# Altium project SSL-MainBoard-2020.PrjPcb
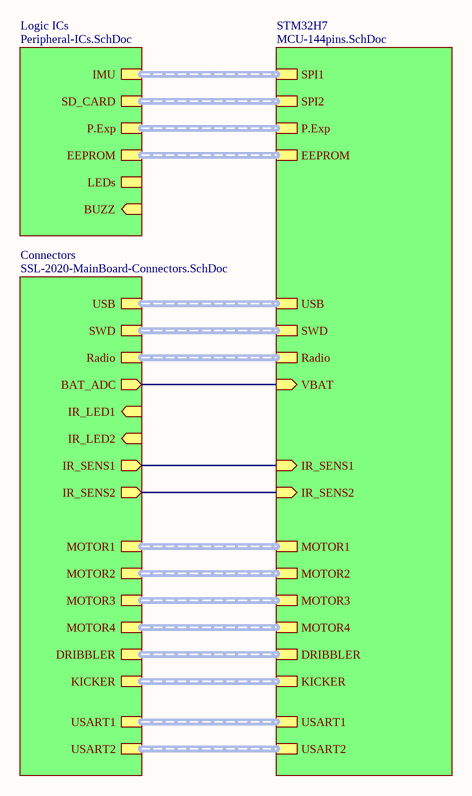
[diagram p0: SSL-2020-MainBoard.SchDoc]
4 sheets, 106 parts. Net scope: hierarchical (ports join the sheet entries above them; power ports are global).
Board file: SSL-2020-MainBoard1.PcbDoc
Sheets:
  SSL-2020-MainBoard.SchDoc
    Logic ICs = Peripheral-ICs.SchDoc
    STM32H7 = MCU-144pins.SchDoc
    Connectors = SSL-2020-MainBoard-Connectors.SchDoc

## Sheet SSL-2020-MainBoard.SchDoc
size A4

### Sub-sheets
Connectors = SSL-2020-MainBoard-Connectors.SchDoc: USB (harness USB-4pins), SWD (harness SWD_4pin), Radio (harness SPI_Harness_6pins), BAT_ADC (out), IR_LED1 (in), IR_LED2 (in), IR_SENS1 (out), IR_SENS2 (out), MOTOR1 (harness MOTOR), MOTOR2 (harness MOTOR), MOTOR3 (harness MOTOR), MOTOR4 (harness MOTOR), DRIBBLER (harness DRIB_SIGNALS), KICKER (harness KICKER), USART1 (harness USART), USART2 (harness USART)
Logic ICs = Peripheral-ICs.SchDoc: IMU (harness SPI_Harness_5pins), SD_CARD (harness SPI_Harness_4pins), P.Exp (harness I2C_Harness_3pins), EEPROM (harness I2C_Harness_2pins), LEDs (harness LEDs), BUZZ (in)
STM32H7 = MCU-144pins.SchDoc: SPI1 (harness SPI_Harness_5pins), SPI2 (harness SPI2_SD-CARD), P.Exp (harness I2C_Harness_3pins), EEPROM (harness I2C_Harness_2pins), USB (harness USB), SWD (harness SWD), Radio (harness SPI3_RADIO), VBAT (in), IR_SENS1 (in), IR_SENS2 (in), MOTOR1 (harness MOTOR), MOTOR2 (harness MOTOR), MOTOR3 (harness MOTOR), MOTOR4 (harness MOTOR), DRIBBLER (harness DRIB_SIGNALS), KICKER (harness KICKER), USART1 (harness USART), USART2 (harness USART)

### Nets
ADC3_INP6: sheet STM32H7/VBAT, sheet Connectors/BAT_ADC
ADC3_INP7: sheet STM32H7/IR_SENS2, sheet Connectors/IR_SENS2
ADC3_INP8: sheet STM32H7/IR_SENS1, sheet Connectors/IR_SENS1

### Buses and harness runs
harness sheet Connectors/DRIBBLER = sheet STM32H7/DRIBBLER
harness sheet Connectors/KICKER = sheet STM32H7/KICKER
harness sheet Connectors/MOTOR1 = sheet STM32H7/MOTOR1
harness sheet Connectors/MOTOR2 = sheet STM32H7/MOTOR2
harness sheet Connectors/MOTOR3 = sheet STM32H7/MOTOR3
harness sheet Connectors/MOTOR4 = sheet STM32H7/MOTOR4
harness sheet Connectors/Radio = sheet STM32H7/Radio
harness sheet Connectors/SWD = sheet STM32H7/SWD
harness sheet Connectors/USART1 = sheet STM32H7/USART1
harness sheet Connectors/USART2 = sheet STM32H7/USART2
harness sheet Connectors/USB = sheet STM32H7/USB
harness sheet Logic ICs/EEPROM = sheet STM32H7/EEPROM
harness sheet Logic ICs/IMU = sheet STM32H7/SPI1
harness sheet Logic ICs/P.Exp = sheet STM32H7/P.Exp
harness sheet Logic ICs/SD_CARD = sheet STM32H7/SPI2

## Sheet Peripheral-ICs.SchDoc
size A4
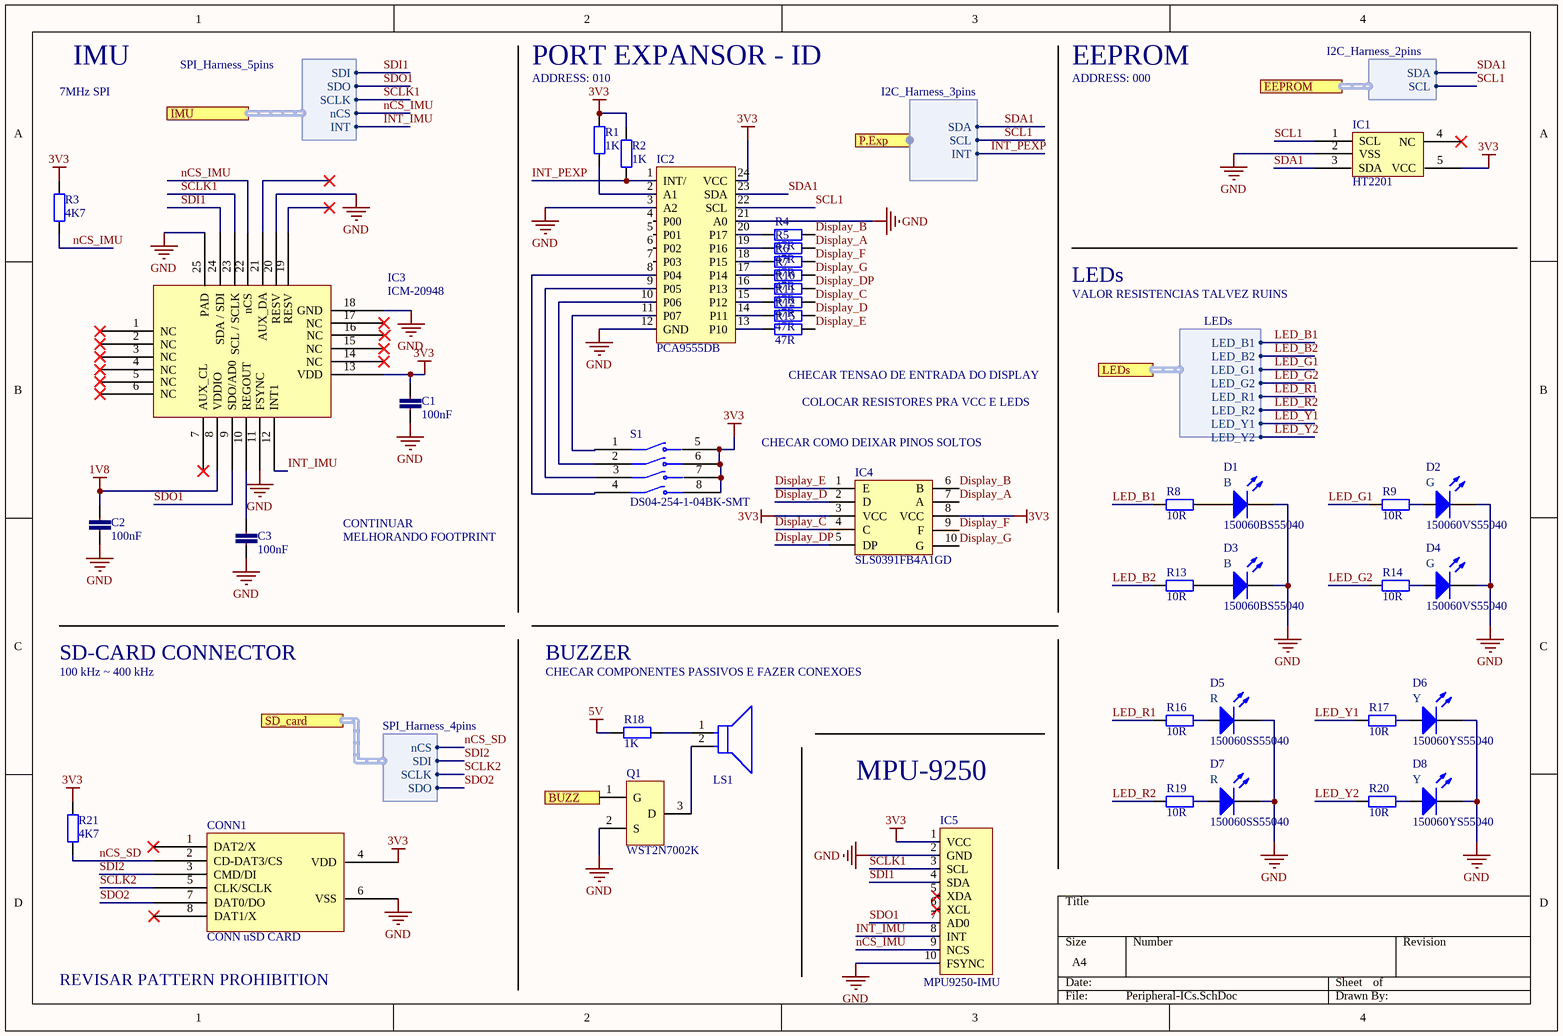
[diagram p1: Peripheral-ICs.SchDoc]

### Parts
C1  100nF  [CAP CER 0603]
C2  100nF  [CAP CER 0603]
C3  100nF  [CAP CER 0603]
CONN1  CONN uSD CARD  [2908-05WB-MG]
D1  150060BS55040  [LED 0603 BLUE]
D2  150060VS55040  [LED 0603 GREEN]
D3  150060BS55040  [LED 0603 BLUE]
D4  150060VS55040  [LED 0603 GREEN]
D5  150060SS55040  [LED 0603 RED]
D6  150060YS55040  [LED 0603 YELLOW]
D7  150060SS55040  [LED 0603 RED]
D8  150060YS55040  [LED 0603 YELLOW]
IC1  HT2201  [SOT-23-5]
IC2  PCA9555DB  [SSOP-24]
IC3  ICM-20948  [ICM-20948]
IC4  SLS0391FB4A1GD  [LDS-SMHTA304RISITR]
IC5  MPU9250-IMU  [MPU9250-IMU]
LS1  Speak_TDK_PS1420P02CT_eec  [TDK_PS1420P02CT_0]  (value not drawn)
Q1  WST2N7002K  [SOT-23-3]
R1  1K  [RES SMD 0603]
R2  1K  [RES SMD 0603]
R3  4K7  [RES SMD 0603]
R4  47R  [RES SMD 0603]
R5  47R  [RES SMD 0603]
R6  47R  [RES SMD 0603]
R7  47R  [RES SMD 0603]
R8  10R  [RES SMD 0603]
R9  10R  [RES SMD 0603]
R10  47R  [RES SMD 0603]
R11  47R  [RES SMD 0603]
R12  47R  [RES SMD 0603]
R13  10R  [RES SMD 0603]
R14  10R  [RES SMD 0603]
R15  47R  [RES SMD 0603]
R16  10R  [RES SMD 0603]
R17  10R  [RES SMD 0603]
R18  1K  [RES SMD 0603]
R19  10R  [RES SMD 0603]
R20  10R  [RES SMD 0603]
R21  4K7  [RES SMD 0603]
S1  DS04-254-1-04BK-SMT  [DS04-254-1-04BK-SMT]

### Ports
BUZZ (in), EEPROM (harness I2C_Harness_2pins), IMU (harness SPI_Harness_5pins), LEDs (harness LEDs), P.Exp (harness I2C_Harness_3pins), SD_card (harness SPI_Harness_4pins)

### Harnesses
SPI_Harness_5pins: SDI, SDO, SCLK, nCS, INT
SPI_Harness_4pins: nCS, SDI, SCLK, SDO
I2C_Harness_3pins: SDA, SCL, INT
I2C_Harness_2pins: SDA, SCL
LEDs: LED_B1, LED_B2, LED_G1, LED_G2, LED_R1, LED_R2, LED_Y1, LED_Y2

### Nets
1V8: C2.1 IC3.8(VDDIO)
3V3: C1.1 CONN1.4(VDD) IC1.5(VCC) IC2.24(VCC) IC3.13(VDD) IC4.3(VCC) IC4.8(VCC) IC5.1(VCC) R1.2 R2.2 R3.2 R21.2 S1.5 S1.6 S1.7 S1.8
5V: R18.2
GND: C1.2 C2.2 C3.2 CONN1.6(VSS) D1.2(N) D2.2(N) D3.2(N) D4.2(N) D5.2(N) D6.2(N) D7.2(N) D8.2(N) IC1.2(VSS) IC2.3(A2) IC2.12(GND) IC2.21(A0) IC3.11(FSYNC) IC3.18(GND) IC3.20(RESV) IC3.25(PAD) IC5.2(GND) IC5.10(FSYNC) Q1.2(S)
Display_A: IC4.7(A) R5.2
Display_B: IC4.6(B) R4.2
Display_C: IC4.4(C) R11.2
Display_D: IC4.2(D) R12.2
Display_DP: IC4.5(DP) R10.2
Display_E: IC4.1(E) R15.2
Display_F: IC4.9(F) R6.2
Display_G: IC4.10(G) R7.2
INT_IMU: IC3.12(INT1) IC5.8(INT) ; port IMU.INT
INT_PEXP: IC2.1(INT/) R2.1 ; port P.Exp.INT
LED_B1: R8.2 ; port LEDs.LED_B1
LED_B2: R13.2 ; port LEDs.LED_B2
LED_G1: R9.2 ; port LEDs.LED_G1
LED_G2: R14.2 ; port LEDs.LED_G2
LED_R1: R16.2 ; port LEDs.LED_R1
LED_R2: R19.2 ; port LEDs.LED_R2
LED_Y1: R17.2 ; port LEDs.LED_Y1
LED_Y2: R20.2 ; port LEDs.LED_Y2
nCS_IMU: IC3.22(nCS) IC5.9(NCS) R3.1 ; port IMU.nCS
nCS_SD: CONN1.2(CD-DAT3/CS) R21.1 ; port SD_card.nCS
SCL1: IC1.1(SCL) IC2.22(SCL) ; port P.Exp.SCL, port EEPROM.SCL  [project net I2C1_SCL]
SCLK1: IC3.23(SCL_/_SCLK) IC5.3(SCL) ; port IMU.SCLK
SCLK2: CONN1.5(CLK/SCLK) ; port SD_card.SCLK
SDA1: IC1.3(SDA) IC2.23(SDA) ; port P.Exp.SDA, port EEPROM.SDA  [project net I2C1_SDA]
SDI1: IC3.24(SDA_/_SDI) IC5.4(SDA) ; port IMU.SDI
SDI2: CONN1.3(CMD/DI) ; port SD_card.SDI
SDO1: IC3.9(SDO/AD0) IC5.7(AD0) ; port IMU.SDO
SDO2: CONN1.7(DAT0/DO) ; port SD_card.SDO
NetC3_1: C3.1 IC3.10(REGOUT)
NetD1_1: D1.1(P) R8.1
NetD2_1: D2.1(P) R9.1
NetD3_1: D3.1(P) R13.1
NetD4_1: D4.1(P) R14.1
NetD5_1: D5.1(P) R16.1
NetD6_1: D6.1(P) R17.1
NetD7_1: D7.1(P) R19.1
NetD8_1: D8.1(P) R20.1
NetIC2_2: IC2.2(A1) R1.1
NetIC2_8: IC2.8(P04) S1.4
NetIC2_9: IC2.9(P05) S1.3
NetIC2_10: IC2.10(P06) S1.2
NetIC2_11: IC2.11(P07) S1.1
NetIC2_13: IC2.13(P10) R15.1
NetIC2_14: IC2.14(P11) R12.1
NetIC2_15: IC2.15(P12) R11.1
NetIC2_16: IC2.16(P13) R10.1
NetIC2_17: IC2.17(P14) R7.1
NetIC2_18: IC2.18(P15) R6.1
NetIC2_19: IC2.19(P16) R5.1
NetIC2_20: IC2.20(P17) R4.1
NetLS1_1: LS1.1 R18.1
NetLS1_2: LS1.2 Q1.3(D)
NetQ1_1: Q1.1(G) ; port BUZZ

Not connected (* = marked no-connect by the designer): CONN1 1(DAT2/X)* 8(DAT1/X)*; IC1 4(NC)*; IC2 4(P00) 5(P01) 6(P02) 7(P03); IC3 1(NC)* 2(NC)* 3(NC)* 4(NC)* 5(NC)* 6(NC)* 7(AUX_CL)* 14(NC)* 15(NC)* 16(NC)* 17(NC)* 19(RESV)* 21(AUX_DA)*; IC5 5(XDA)* 6(XCL)*

### Notes on the sheet
- 7MHz SPI
- IMU
- ADDRESS: 010
- PORT EXPANSOR - ID
- ADDRESS: 000
- EEPROM
- LEDs
- VALOR RESISTENCIAS TALVEZ RUINS
- CHECAR TENSAO DE ENTRADA DO DISPLAY
- (near IC4) CHECAR COMO DEIXAR PINOS SOLTOS
- COLOCAR RESISTORES PRA VCC E LEDS
- CONTINUAR
- MELHORANDO FOOTPRINT
- SD-CARD CONNECTOR
- 100 kHz ~ 400 kHz
- CHECAR COMPONENTES PASSIVOS E FAZER CONEXOES
- BUZZER
- MPU-9250
- REVISAR PATTERN PROHIBITION
- (in symbol 150060BS55040) B
- (in symbol 150060SS55040) R
- (in symbol 150060VS55040) G
- (in symbol 150060YS55040) Y

### Library data of the parts
C1-C3 = CAP CER 0603 25V 100nF: Multilayer Ceramic Capacitors MLCC - SMD/SMT 25V 0.1uF 0603 Y5V -20/+80%; Mfr Nr: C0603C104Z3VACTU; Mfr: KEMET; Type: Ceramic Capacitor; Dimensions: 0603 (1608 metric); Voltage Rating: 25V; Series: SMD Comm Y5V; Value: 100nF
CONN1 = 2908-05WB-MG: 8 Position Card Connector Secure Digital - microSD™ Surface Mount, Right Angle Gold; ComponentLink1Description: Datasheet; ComponentLink1URL: https://multimedia.3m.com/mws/media/416257O/3mtm-card-connector-microsdtm-2900-series-ts2197.pdf
D1 D3 = 150060BS55040: Standard LEDs - SMD WL-SMCD SMD Mono SMD 0603 Blue 465nm; Mfr: Wurth Elektronik; Forward Current: 20mA; Forward Voltage: 2V; Package: 0603 (1608 metric); Series: WL-SMCD; Color: Blue
D2 D4 = 150060VS55040: Standard LEDs - SMD WL-SMCD SMD MonoChip 0603 BrtGrn 575nm; Mfr: Wurth Elektronik; Forward Current: 20mA; Forward Voltage: 2V; Color: Green; Package: 0603 (1608 metric); Series: WL-SMCD
D5 D7 = 150060SS55040: Standard LEDs - SMD WL-SMCD SMD MonoChip 0603 Super Red 645nm; Mfr: Wurth Elektronik; Forward Current: 20mA; Forward Voltage: 2V; Package: 0603 (1608 metric); Series: WL-SMCD; Color: Red
D6 D8 = 150060YS55040: Standard LEDs - SMD WL-SMCD SMD MonoChip 0603 Yllw 591nm; Mfr: Wurth Elektronik; Forward Current: 20mA; Forward Voltage: 2V; Color: Yellow; Package: 0603 (1608 metric); Series: WL-SMCD
IC1 = HT2201: EEPROM EEPROM 1KB (128 X 8) I2C SOT-23-5 ROHS; Mfr: Holtek Semicon; Mfr Nr: HT2201; Package: SOT-23-5
IC2 = PCA9555DB: INTERFACE - I/O EXPANDERS SSOP-24 ROHS; Mfr: NXP Semicon; Mfr Nr: PCA9555DB,118; Nr of I/Os: 16 I/O; Supply Voltage: 5.5V; Package: SSOP-24_5.3x8.2x0.65P
IC3 = ICM-20948: IMU ACCEL/GYRO/COMPI2C/SPI 24QFN; ComponentLink1Description: Datasheet; ComponentLink1URL: https://invensense.tdk.com/wp-content/uploads/2016/06/DS-000189-ICM-20948-v1.3.pdf
IC4 = SLS0391FB4A1GD: 1 0.39''(9.91MM) ANODE(POSITIVE ELECTRODE) BLUE 473NM SMD LED SEGMENT DISPLAY ROHS; Mfr: SUNLIGHT; ComponentLink1Description: Datasheet; ComponentLink1URL: https://www.lumex.com/spec/LDS-SMHTA304RISITR.pdf; Mfr Nr: SLS0391FB4A1GD; Package: SMD-10_9.8x13.0x1.88P
LS1 = Speak_TDK_PS1420P02CT_eec: SPEAK AUDIO PIEZO TRANSDUCER 30V TH; Manufacturer: TDK; Part Number: PS1420P02CT; helpURL: https://upverter.com/upn/revision/c40fcc79eb057440/; ComponentLink2Description: Datasheet; Temperature: -10°C to +70°C; Package: PTH_BZ; Supplier 2: Mouser; Price: 0.484234236378; Supplier 1: Digi-Key; ComponentLink1URL: https://upverter.com/upn/revision/c40fcc79eb057440/; Supplier Part Number 2: 810-PS1420P02CT; Supplier Part Number 1: 445-2526-1-ND; ComponentLink1Description: Upverter; ComponentLink2URL: https://upverter.com/datasheet/458958daf548c3d54cf9a7d1ea1ff395e223655a.pdf; RoHS: TRUE; Mouser Part Number: 810-PS1420P02CT; Ipc Land Pattern Name: CAPRD500W80D1400H1100; Temperature Range High: +70°C; Digikey Description: SPEAK AUDIO PIEZO TRANSDUCER 30V TH; Digikey Part Number: 445-2526-1-ND; Lead Free: yes; Temperature Range Low: -10°C
Q1 = WST2N7002K: MOSFET N TRENCH 60V 300MA 2.5V @ 250UA 3 ? @ 500MA,10V SOT-23(SOT-23-3) ROHS; Mfr: Winsok Semicon; ComponentLink1Description: Datasheet; ComponentLink1URL: https://br.mouser.com/datasheet/2/408/T2N7002AK_datasheet_en_20150401-708738.pdf; Mfr Nr: WST2N7002K; Package: SOT-23-3
R1 R2 R18 = RES SMD 0603 1K: Thick Film Resistors 1/10Watt 1Kohms 1% Commercial Use; Mfr: Vishay / Dale; Mfr Nr: CRCW06031K00FKEAC; Power Rating: 1/10 W; Dimensions: 0603 (1608 metric); Value: 1K
R3 R21 = RES SMD 0603 4K7
R4-R7 R10-R12 R15 = RES SMD 0603 47R: Thick Film Resistors 1/10Watt 47ohms 1% Commercial Use; Mfr: Vishay / Dale; Mfr Nr: CRCW060347R0FKEAC; Power Rating: 1/10 W; Dimensions: 0603 (1608 metric); Value: 47R
R8 R9 R13 R14 R16 R17 R19 R20 = RES SMD 0603 10R: Thick Film Resistors 1/10Watt 10ohms 1% Commercial Use; Mfr: Vishay / Dale; Mfr Nr: CRCW060310R0FKEAC; Power Rating: 1/10 W; Dimensions: 0603 (1608 metric); Value: 10R
S1 = DS04-254-1-04BK-SMT: Dip Switch SPST 4 Position Surface Mount Slide (Standard) Actuator 25mA 24VDC; ComponentLink1Description: Datasheet; ComponentLink1URL: https://br.mouser.com/datasheet/2/670/ds04-254-smt-1777718.pdf

## Sheet MCU-144pins.SchDoc
size A3
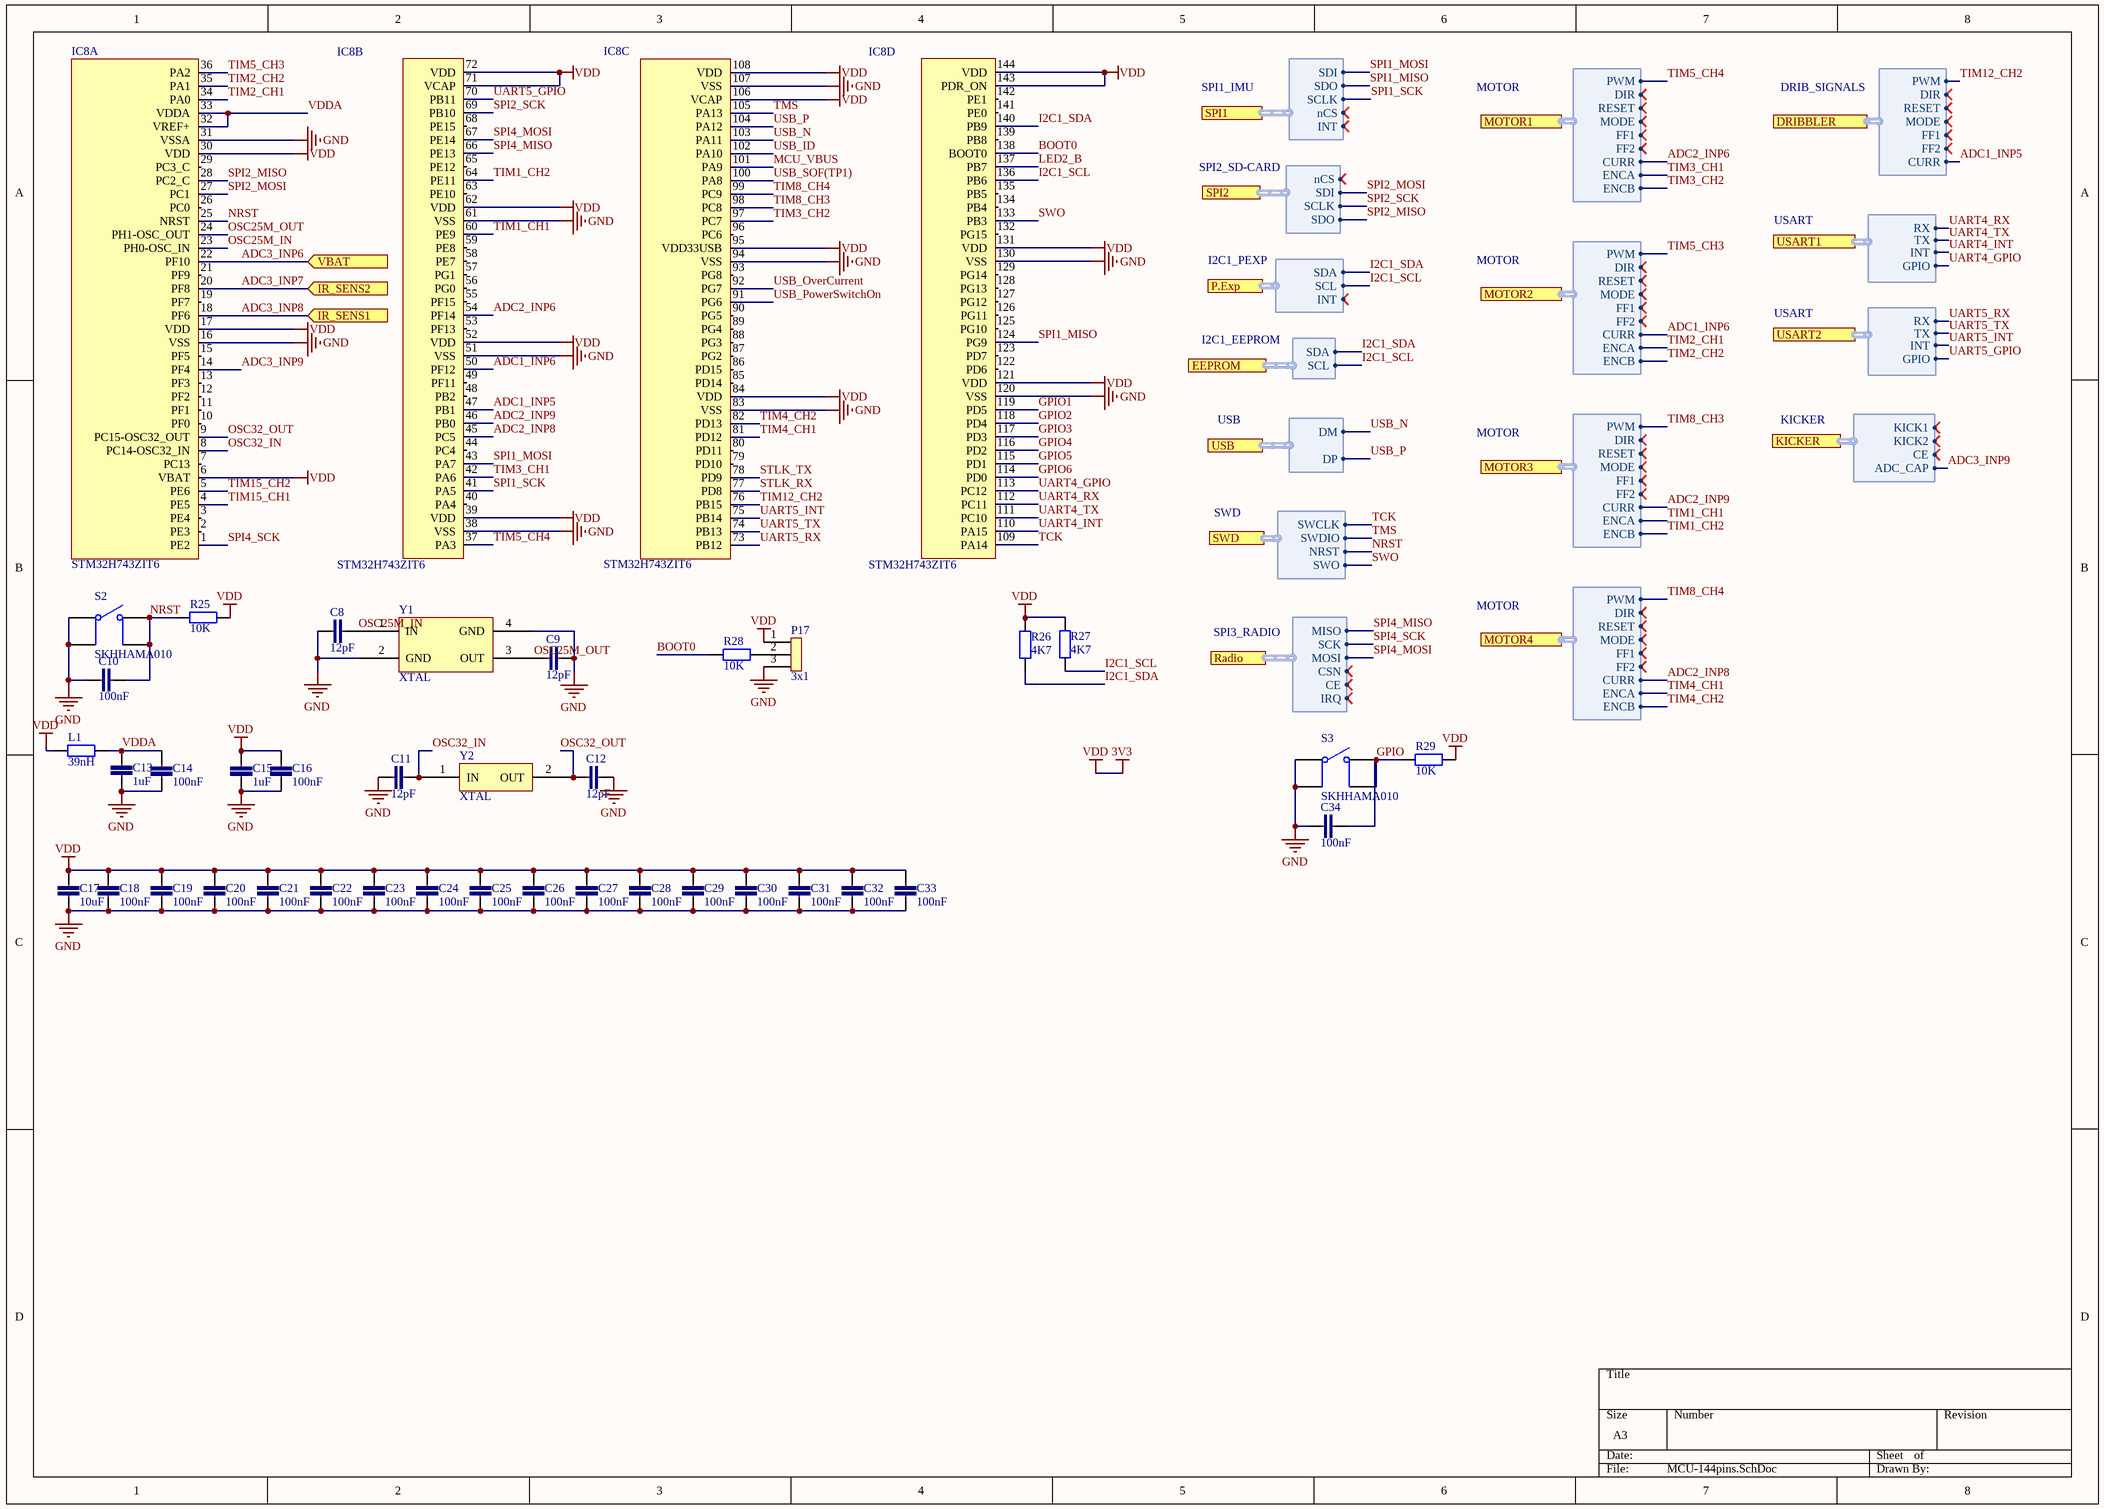
[diagram p2: MCU-144pins.SchDoc]

### Parts
C8  12pF  [CAP CER 0603]
C9  12pF  [CAP CER 0603]
C10  100nF  [CAP CER 0603]
C11  12pF  [CAP CER 0603]
C12  12pF  [CAP CER 0603]
C13  1uF  [CAP CER 0603]
C14  100nF  [CAP CER 0603]
C15  1uF  [CAP CER 0603]
C16  100nF  [CAP CER 0603]
C17  10uF  [CAP CER 0603]
C18  100nF  [CAP CER 0603]
C19  100nF  [CAP CER 0603]
C20  100nF  [CAP CER 0603]
C21  100nF  [CAP CER 0603]
C22  100nF  [CAP CER 0603]
C23  100nF  [CAP CER 0603]
C24  100nF  [CAP CER 0603]
C25  100nF  [CAP CER 0603]
C26  100nF  [CAP CER 0603]
C27  100nF  [CAP CER 0603]
C28  100nF  [CAP CER 0603]
C29  100nF  [CAP CER 0603]
C30  100nF  [CAP CER 0603]
C31  100nF  [CAP CER 0603]
C32  100nF  [CAP CER 0603]
C33  100nF  [CAP CER 0603]
C34  100nF  [CAP CER 0603]
IC8  STM32H743ZIT6  [LQFP-144]  (parts A,B,C,D of 4)
L1  39nH  [IND SMD 0603]
P17  3x1  [HEADER 3X1 MALE]
R25  10K  [RES SMD 0603]
R26  4K7  [RES SMD 0603]
R27  4K7  [RES SMD 0603]
R28  10K  [RES SMD 0603]
R29  10K  [RES SMD 0603]
S2  SKHHAMA010  [TACT-SWITCH-6X6X5]
S3  SKHHAMA010  [TACT-SWITCH-6X6X5]
Y1  XTAL  [XTAL-200X160]
Y2  XTAL  [XTAL-200X120]

### Ports
DRIBBLER (harness DRIB_SIGNALS), EEPROM (harness I2C1_EEPROM), IR_SENS1 (in), IR_SENS2 (in), KICKER (harness KICKER), MOTOR1 (harness MOTOR), MOTOR2 (harness MOTOR), MOTOR3 (harness MOTOR), MOTOR4 (harness MOTOR), P.Exp (harness I2C1_PEXP), Radio (harness SPI3_RADIO), SPI1 (harness SPI1_IMU), SPI2 (harness SPI2_SD-CARD), SWD (harness SWD), USART1 (harness USART), USART2 (harness USART), USB (harness USB), VBAT (in)

### Harnesses
SPI1_IMU: SDI, SDO, SCLK, nCS, INT
I2C1_PEXP: SDA, SCL, INT
SPI2_SD-CARD: nCS, SDI, SCLK, SDO
I2C1_EEPROM: SDA, SCL
SWD: SWCLK, SWDIO, NRST, SWO
USB: DM, DP
SPI3_RADIO: MISO, SCK, MOSI, CSN, CE, IRQ
MOTOR: PWM, DIR, RESET, MODE, FF1, FF2, CURR, ENCA, ENCB
DRIB_SIGNALS: PWM, DIR, RESET, MODE, FF1, FF2, CURR
USART: RX, TX, INT, GPIO
KICKER: KICK1, KICK2, CE, ADC_CAP

### Nets
3V3: C15.1 C16.1 C17.1 C18.1 C19.1 C20.1 C21.1 C22.1 C23.1 C24.1 C25.1 C26.1 C27.1 C28.1 C29.1 C30.1 C31.1 C32.1 C33.1 IC8.6(VBAT) IC8.17(VDD) IC8.30(VDD) IC8.39(VDD) IC8.52(VDD) IC8.62(VDD) IC8.71(VCAP) IC8.72(VDD) IC8.84(VDD) IC8.95(VDD33USB) IC8.106(VCAP) IC8.108(VDD) IC8.121(VDD) IC8.131(VDD) IC8.143(PDR_ON) IC8.144(VDD) L1.2 P17.1 R25.1 R26.2 R27.2 R29.1  [also labelled VDD]
GND: C8.1 C9.2 C10.1 C11.1 C12.2 C13.2 C14.2 C15.2 C16.2 C17.2 C18.2 C19.2 C20.2 C21.2 C22.2 C23.2 C24.2 C25.2 C26.2 C27.2 C28.2 C29.2 C30.2 C31.2 C32.2 C33.2 C34.1 IC8.16(VSS) IC8.31(VSSA) IC8.38(VSS) IC8.51(VSS) IC8.61(VSS) IC8.83(VSS) IC8.94(VSS) IC8.107(VSS) IC8.120(VSS) IC8.130(VSS) P17.3 S2.1 S2.2 S3.1 S3.2 Y1.2(GND) Y1.4(GND)
ADC1_INP5: IC8.47(PB1) ; port DRIBBLER.CURR
ADC1_INP6: IC8.50(PF12) ; port MOTOR2.CURR
ADC2_INP6: IC8.54(PF14) ; port MOTOR1.CURR
ADC2_INP8: IC8.45(PC5) ; port MOTOR4.CURR
ADC2_INP9: IC8.46(PB0) ; port MOTOR3.CURR
ADC3_INP6: IC8.22(PF10) ; port VBAT
ADC3_INP7: IC8.20(PF8) ; port IR_SENS2
ADC3_INP8: IC8.18(PF6) ; port IR_SENS1
ADC3_INP9: IC8.14(PF4) ; port KICKER.ADC_CAP
BOOT0: IC8.138(BOOT0) R28.2
GPIO: C34.2 R29.2 S3.3 S3.4
GPIO1: IC8.119(PD5)
GPIO2: IC8.118(PD4)
GPIO3: IC8.117(PD3)
GPIO4: IC8.116(PD2)
GPIO5: IC8.115(PD1)
GPIO6: IC8.114(PD0)
I2C1_SCL: IC8.136(PB6) R27.1 ; port P.Exp.SCL, port EEPROM.SCL
I2C1_SDA: IC8.140(PB9) R26.1 ; port P.Exp.SDA, port EEPROM.SDA
LED2_B: IC8.137(PB7)
MCU_VBUS: IC8.101(PA9)
NRST: C10.2 IC8.25(NRST) R25.2 S2.3 S2.4 ; port SWD.NRST
OSC25M_IN: C8.2 IC8.23(PH0-OSC_IN) Y1.1(IN)
OSC25M_OUT: C9.1 IC8.24(PH1-OSC_OUT) Y1.3(OUT)
OSC32_IN: C11.2 IC8.8(PC14-OSC32_IN) Y2.1(IN)
OSC32_OUT: C12.1 IC8.9(PC15-OSC32_OUT) Y2.2(OUT)
SPI1_MISO: IC8.124(PG9) ; port SPI1.SDO  [project net SDO1]
SPI1_MOSI: IC8.43(PA7) ; port SPI1.SDI  [project net SDI1]
SPI1_SCK: IC8.41(PA5) ; port SPI1.SCLK  [project net SCLK1]
SPI2_MISO: IC8.28(PC2_C) ; port SPI2.SDO  [project net SDO2]
SPI2_MOSI: IC8.27(PC1) ; port SPI2.SDI  [project net SDI2]
SPI2_SCK: IC8.69(PB10) ; port SPI2.SCLK  [project net SCLK2]
SPI4_MISO: IC8.66(PE13) ; port Radio.MISO  [project net MISO_NRF]
SPI4_MOSI: IC8.67(PE14) ; port Radio.MOSI  [project net MOSI_NRF]
SPI4_SCK: IC8.1(PE2) ; port Radio.SCK  [project net SCK_NRF]
STLK_RX: IC8.77(PD8)
STLK_TX: IC8.78(PD9)
SWO: IC8.133(PB3) ; port SWD.SWO
TCK: IC8.109(PA14) ; port SWD.SWCLK  [project net SWCLK]
TIM1_CH1: IC8.60(PE9) ; port MOTOR3.ENCA  [project net ENCA_M3]
TIM1_CH2: IC8.64(PE11) ; port MOTOR3.ENCB  [project net ENCB_M3]
TIM2_CH1: IC8.34(PA0) ; port MOTOR2.ENCA  [project net ENCA_M2]
TIM2_CH2: IC8.35(PA1) ; port MOTOR2.ENCB  [project net ENCB_M2]
TIM3_CH1: IC8.42(PA6) ; port MOTOR1.ENCA  [project net ENCA_M1]
TIM3_CH2: IC8.97(PC7) ; port MOTOR1.ENCB  [project net ENCB_M1]
TIM4_CH1: IC8.81(PD12) ; port MOTOR4.ENCA  [project net ENCA_M4]
TIM4_CH2: IC8.82(PD13) ; port MOTOR4.ENCB  [project net ENCB_M4]
TIM5_CH3: IC8.36(PA2) ; port MOTOR2.PWM  [project net PWM_M2]
TIM5_CH4: IC8.37(PA3) ; port MOTOR1.PWM  [project net PWM_M1]
TIM8_CH3: IC8.98(PC8) ; port MOTOR3.PWM  [project net PWM_M3]
TIM8_CH4: IC8.99(PC9) ; port MOTOR4.PWM  [project net PWM_M4]
TIM12_CH2: IC8.76(PB15) ; port DRIBBLER.PWM  [project net PWM_D]
TIM15_CH1: IC8.4(PE5)
TIM15_CH2: IC8.5(PE6)
TMS: IC8.105(PA13) ; port SWD.SWDIO  [project net SWDIO]
UART4_GPIO: IC8.113(PC12) ; port USART1.GPIO
UART4_INT: IC8.110(PA15) ; port USART1.INT
UART4_RX: IC8.112(PC11) ; port USART1.RX
UART4_TX: IC8.111(PC10) ; port USART1.TX
UART5_GPIO: IC8.70(PB11) ; port USART2.GPIO
UART5_INT: IC8.75(PB14) ; port USART2.INT
UART5_RX: IC8.73(PB12) ; port USART2.RX
UART5_TX: IC8.74(PB13) ; port USART2.TX
USB_ID: IC8.102(PA10)
USB_N: IC8.103(PA11) ; port USB.DM
USB_OverCurrent: IC8.92(PG7)
USB_P: IC8.104(PA12) ; port USB.DP
USB_PowerSwitchOn: IC8.91(PG6)
USB_SOF(TP1): IC8.100(PA8)
VDDA: C13.1 C14.1 IC8.32(VREF+) IC8.33(VDDA) L1.1
NetP17_2: P17.2 R28.1

Not connected (* = marked no-connect by the designer): IC8 2(PE3) 3(PE4) 7(PC13) 10(PF0) 11(PF1) 12(PF2) 13(PF3) 15(PF5) 19(PF7) 21(PF9) 26(PC0) 29(PC3_C) 40(PA4) 44(PC4) 48(PB2) 49(PF11) 53(PF13) 55(PF15) 56(PG0) 57(PG1) 58(PE7) 59(PE8) 63(PE10) 65(PE12) 68(PE15) 79(PD10) 80(PD11) 85(PD14) 86(PD15) 87(PG2) 88(PG3) 89(PG4) 90(PG5) 93(PG8) 96(PC6) 122(PD6) 123(PD7) 125(PG10) 126(PG11) 127(PG12) 128(PG13) 129(PG14) 132(PG15) 134(PB4) 135(PB5) 139(PB8) 141(PE0) 142(PE1)

### Library data of the parts
C8 C9 C11 C12 = CAP CER 0603 50V 12pF: Multilayer Ceramic Capacitors MLCC - SMD/SMT 50V 12pF 0603 C0G 5%; Mfr Nr: C0603C120J5GAC; Mfr: KEMET; Type: Ceramic Capacitor; Dimensions: 0603 (1608 metric); Series: SMD Comm C0G; Voltage Rating: 50V; Value: 12pF
C10 C14 C16 C18-C34 = CAP CER 0603 25V 100nF: as C1 on sheet Peripheral-ICs; Type: Ceramic Capacitor; Dimensions: 0603 (1608 metric); Voltage Rating: 25V; Series: SMD Comm Y5V; Value: 100nF
C13 C15 = CAP CER 0603 25V 1uF: Multilayer Ceramic Capacitors MLCC - SMD/SMT 1uF 25V X5R 10%; Mfr Nr: C0603C105K3PAC7411; Mfr: KEMET; Type: Ceramic Capacitor; Dimensions: 0603 (1608 metric); Voltage Rating: 25V; Series: SMD Comm X5R; Value: 1uF
C17 = CAP CER 0603 6.3V 10uF: Multilayer Ceramic Capacitors MLCC - SMD/SMT 0603 6.3V 10uF X5R 10% Soft Term; Mfr Nr: C1608X5R0J106K080AE; Mfr: TDK; Type: Ceramic Capacitor; Dimensions: 0603 (1608 metric); Voltage Rating: 6.3V; Series: C; Value: 10uF
IC8 = STM32H743ZIT6: ARM Microcontrollers - MCU High-performance and DSP with DP-FPU, ARM Cortex-M7 MCU with 2MBytes Flash, 1MB RAM, 400 MHz CPU, Art Accelerator, L1 cache, external memory interface, large set of peripherals; Mfr: STMicroelectronics; Core: ARM Cortex M7; Mfr Nr: STM32H743ZIT6; Package: LQFP-144; Series: STM32H743ZI
L1 = IND SMD 0603 300mA: FIXED IND 39NH 300MA 600 MOHM; ComponentLink1Description: New link; ComponentLink1URL: https://www.mouser.ie/ProductDetail/Wurth-Elektronik/7447860139?qs=sPbYRqrBIVnOGz9%2FqJxoDA%3D%3D
P17 = HEADER 3P M: Headers & Wire Housings 03 SIL VERTICAL PIN HEADER TIN; Mfr Nr: M20-9770346
R25 R28 R29 = RES SMD 0603 10K: Thick Film Resistors - SMD 1/10Watt 10Kohms 1% Commercial Use; Mfr: Vishay / Dale; Mfr Nr: CRCW060310K0FKEAC; Power Rating: 1/10 W; Dimensions: 0603 (1608 metric); Value: 10K
R26 R27 = RES SMD 0603 4K7
S2 S3 = SKHHAMA010: Tactile Switches 6.0x6.0x5.0mm 160gf; Mfr: ALPS; Contact Form: SPST; Voltage Rating: 12 VDC; Current Rating: 50 mA; Mfr Nr: SKHHAMA010; Series: SKHH; Type: Tactile Switch
Y1 = FA-12825F10Z-AC: Crystals 25MHz 10PPM -20C +75C 9.0pF; Mfr Nr: FA-128  25.0000MF10Z-AC; Mfr: Epson Timing; Load Capacitance: 9 pF; ESR: 80 Ohms; Package: 2 mm x 1.6 mm; Frequency: 25 MHz; Series: FA-128; Tolerance: 10 PPM
Y2 = ABS06-32.768KHZ-9-T: Crystals 32.768KHz 9pF 20ppm -40 C+85C; Mfr: ABRACON; ESR: 90 kOhms; Mfr Nr: ABS06-32.768KHZ-9-T; Package: 2 mm x 1.6 mm; Load Capacitance: 9 pF; Frequency: 32.768 kHz; Series: ABS06; Tolerance: 20 PPM

## Sheet SSL-2020-MainBoard-Connectors.SchDoc
size A4
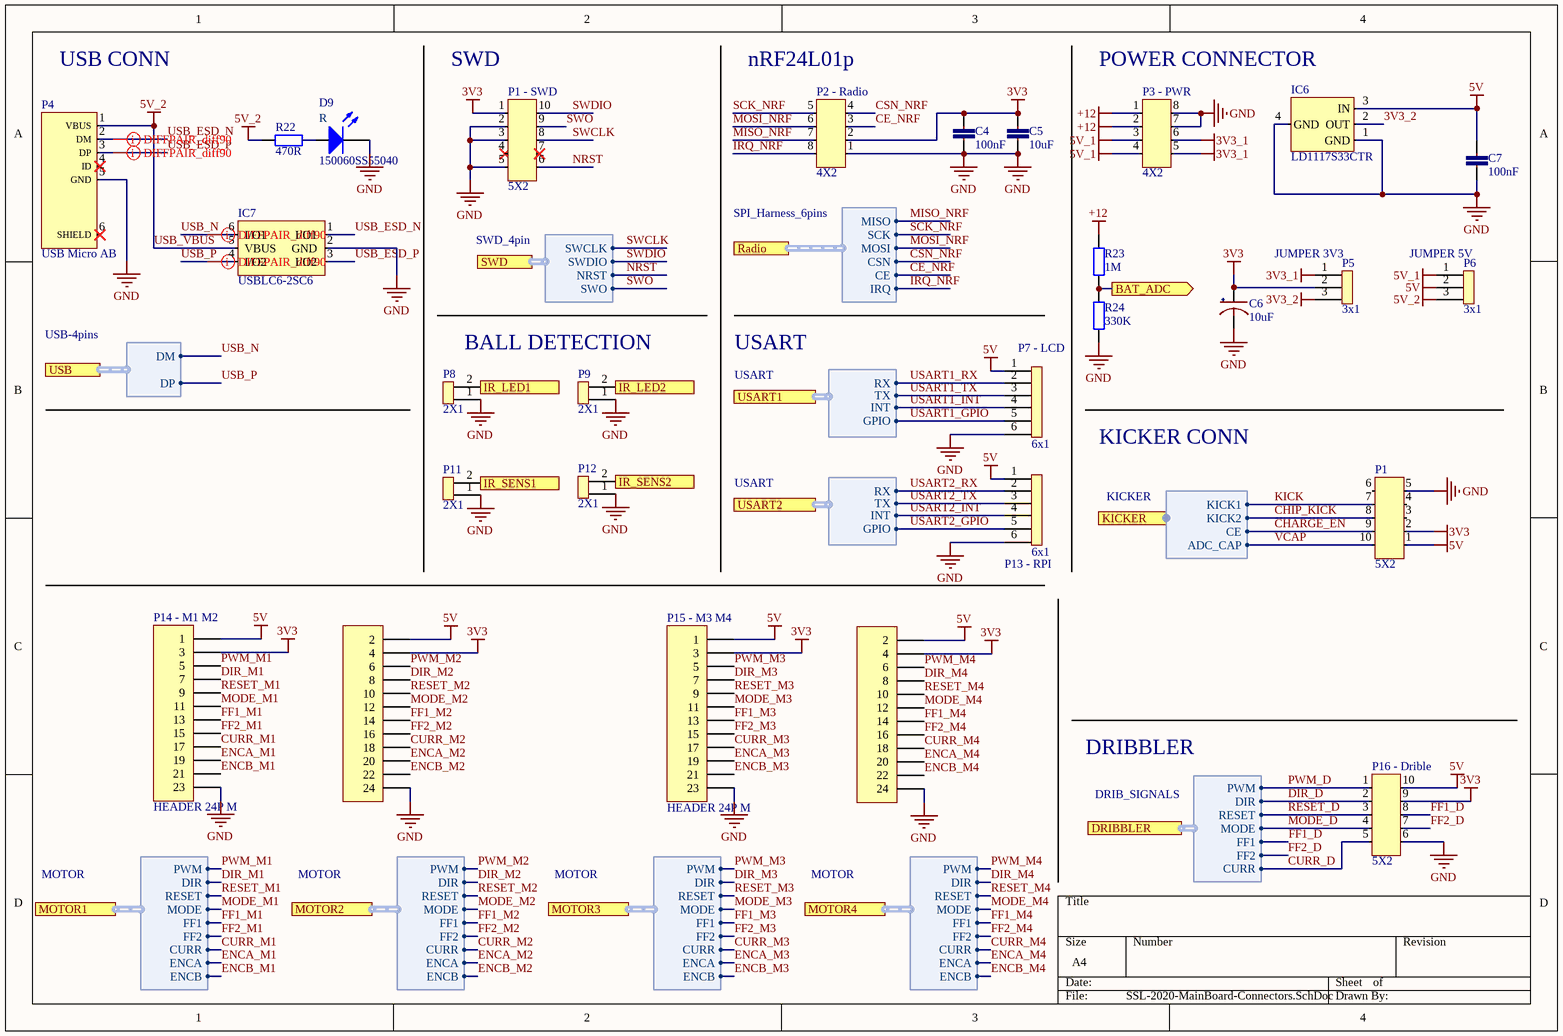
[diagram p3: SSL-2020-MainBoard-Connectors.SchDoc]

### Parts
C4  100nF  [CAP CER 0603]
C5  10uF  [CAP CER 0603]
C6  10uF  [CAP ALUM 5X5]
C7  100nF  [CAP CER 0603]
D9  150060SS55040  [LED 0603 RED]
IC6  LD1117S33CTR  [SOT-223]
IC7  USBLC6-2SC6  [SOT-23-6]
P1  5X2  [HEADER 5X2 MALE]
P1_-_SWD  5X2  [HEADER SWD]
P2_-_Radio  4X2  [NRF24L01P+HEADER]
P3_-_PWR  4X2  [HEADER 4X2 FEM]
P4  USB Micro AB  [USB-MICRO-AB]
P5  3x1  [HEADER 3X1 MALE]
P6  3x1  [HEADER 3X1 MALE]
P7_-_LCD  6x1  [HEADER 6X1 MALE]
P8  2X1  [HEADER 2X1 MALE]
P9  2X1  [HEADER 2X1 MALE]
P11  2X1  [HEADER 2X1 MALE]
P12  2X1  [HEADER 2X1 MALE]
P13_-_RPI  6x1  [HEADER 6X1 MALE]
P14_-_M1_M2  HEADER 24P M  [HEADER 12X2 MALE]
P15_-_M3_M4  HEADER 24P M  [HEADER 12X2 MALE]
P16_-_Drible  5X2  [HEADER 5X2 MALE]
R22  470R  [RES SMD 0603]
R23  1M  [RES SMD 0603]
R24  330K  [RES SMD 0603]

### Ports
BAT_ADC (out), DRIBBLER (harness DRIB_SIGNALS), IR_LED1 (in), IR_LED2 (in), IR_SENS1 (out), IR_SENS2 (out), KICKER (harness KICKER), MOTOR1 (harness MOTOR), MOTOR2 (harness MOTOR), MOTOR3 (harness MOTOR), MOTOR4 (harness MOTOR), Radio (harness SPI_Harness_6pins), SWD (harness SWD_4pin), USART1 (harness USART), USART2 (harness USART), USB (harness USB-4pins)

### Harnesses
USB-4pins: DM, DP
SWD_4pin: SWCLK, SWDIO, NRST, SWO
SPI_Harness_6pins: MISO, SCK, MOSI, CSN, CE, IRQ
MOTOR: PWM, DIR, RESET, MODE, FF1, FF2, CURR, ENCA, ENCB
USART: RX, TX, INT, GPIO
DRIB_SIGNALS: PWM, DIR, RESET, MODE, FF1, FF2, CURR
KICKER: KICK1, KICK2, CE, ADC_CAP

### Nets
3V3: C4.1 C5.1 C6.1 P1.2 P1_-_SWD.1 P2_-_Radio.2 P5.2 P14_-_M1_M2.3 P14_-_M1_M2.4 P15_-_M3_M4.3 P15_-_M3_M4.4 P16_-_Drible.9
3V3_1: P3_-_PWR.5 P3_-_PWR.6 P5.1
3V3_2: IC6.2(OUT) P5.3
5V: C7.1 IC6.3(IN) P1.1 P6.2 P7_-_LCD.1 P13_-_RPI.1 P14_-_M1_M2.1 P14_-_M1_M2.2 P15_-_M3_M4.1 P15_-_M3_M4.2 P16_-_Drible.10
5V_1: P3_-_PWR.3 P3_-_PWR.4 P6.1
+12: P3_-_PWR.1 P3_-_PWR.2 R23.2
GND: C4.2 C5.2 C6.2 C7.2 D9.2(N) IC6.1(GND) IC6.4(GND) IC7.2(GND) P1.5 P1_-_SWD.2 P1_-_SWD.3 P1_-_SWD.5 P2_-_Radio.1 P3_-_PWR.7 P3_-_PWR.8 P4.5(GND) P7_-_LCD.6 P8.1 P9.1 P11.1 P12.1 P13_-_RPI.6 P14_-_M1_M2.23 P14_-_M1_M2.24 P15_-_M3_M4.23 P15_-_M3_M4.24 P16_-_Drible.6 R24.1
USB_VBUS: IC7.5(VBUS) P4.1(VBUS) P6.3 R22.2  [also labelled 5V_2]
ADC3_INP6: R23.1 R24.2 ; port BAT_ADC
ADC3_INP7: P12.2 ; port IR_SENS2
ADC3_INP8: P11.2 ; port IR_SENS1
CE_NRF: P2_-_Radio.3 ; port Radio.CE
CHARGE_EN: P1.9 ; port KICKER.CE
CHIP_KICK: P1.8 ; port KICKER.KICK2
CSN_NRF: P2_-_Radio.4 ; port Radio.CSN
CURR_D: P16_-_Drible.5 ; port DRIBBLER.CURR  [project net ADC1_INP5]
CURR_M1: P14_-_M1_M2.17 ; port MOTOR1.CURR  [project net ADC2_INP6]
CURR_M2: P14_-_M1_M2.18 ; port MOTOR2.CURR  [project net ADC1_INP6]
CURR_M3: P15_-_M3_M4.17 ; port MOTOR3.CURR  [project net ADC2_INP9]
CURR_M4: P15_-_M3_M4.18 ; port MOTOR4.CURR  [project net ADC2_INP8]
DIR_D: P16_-_Drible.2 ; port DRIBBLER.DIR
DIR_M1: P14_-_M1_M2.7 ; port MOTOR1.DIR
DIR_M2: P14_-_M1_M2.8 ; port MOTOR2.DIR
DIR_M3: P15_-_M3_M4.7 ; port MOTOR3.DIR
DIR_M4: P15_-_M3_M4.8 ; port MOTOR4.DIR
ENCA_M1: P14_-_M1_M2.19 ; port MOTOR1.ENCA
ENCA_M2: P14_-_M1_M2.20 ; port MOTOR2.ENCA
ENCA_M3: P15_-_M3_M4.19 ; port MOTOR3.ENCA
ENCA_M4: P15_-_M3_M4.20 ; port MOTOR4.ENCA
ENCB_M1: P14_-_M1_M2.21 ; port MOTOR1.ENCB
ENCB_M2: P14_-_M1_M2.22 ; port MOTOR2.ENCB
ENCB_M3: P15_-_M3_M4.21 ; port MOTOR3.ENCB
ENCB_M4: P15_-_M3_M4.22 ; port MOTOR4.ENCB
FF1_D: P16_-_Drible.8 ; port DRIBBLER.FF1
FF1_M1: P14_-_M1_M2.13 ; port MOTOR1.FF1
FF1_M2: P14_-_M1_M2.14 ; port MOTOR2.FF1
FF1_M3: P15_-_M3_M4.13 ; port MOTOR3.FF1
FF1_M4: P15_-_M3_M4.14 ; port MOTOR4.FF1
FF2_D: P16_-_Drible.7 ; port DRIBBLER.FF2
FF2_M1: P14_-_M1_M2.15 ; port MOTOR1.FF2
FF2_M2: P14_-_M1_M2.16 ; port MOTOR2.FF2
FF2_M3: P15_-_M3_M4.15 ; port MOTOR3.FF2
FF2_M4: P15_-_M3_M4.16 ; port MOTOR4.FF2
IRQ_NRF: P2_-_Radio.8 ; port Radio.IRQ
KICK: P1.7 ; port KICKER.KICK1
MISO_NRF: P2_-_Radio.7 ; port Radio.MISO
MODE_D: P16_-_Drible.4 ; port DRIBBLER.MODE
MODE_M1: P14_-_M1_M2.11 ; port MOTOR1.MODE
MODE_M2: P14_-_M1_M2.12 ; port MOTOR2.MODE
MODE_M3: P15_-_M3_M4.11 ; port MOTOR3.MODE
MODE_M4: P15_-_M3_M4.12 ; port MOTOR4.MODE
MOSI_NRF: P2_-_Radio.6 ; port Radio.MOSI
NRST: P1_-_SWD.6 ; port SWD.NRST
PWM_D: P16_-_Drible.1 ; port DRIBBLER.PWM
PWM_M1: P14_-_M1_M2.5 ; port MOTOR1.PWM
PWM_M2: P14_-_M1_M2.6 ; port MOTOR2.PWM
PWM_M3: P15_-_M3_M4.5 ; port MOTOR3.PWM
PWM_M4: P15_-_M3_M4.6 ; port MOTOR4.PWM
RESET_D: P16_-_Drible.3 ; port DRIBBLER.RESET
RESET_M1: P14_-_M1_M2.9 ; port MOTOR1.RESET
RESET_M2: P14_-_M1_M2.10 ; port MOTOR2.RESET
RESET_M3: P15_-_M3_M4.9 ; port MOTOR3.RESET
RESET_M4: P15_-_M3_M4.10 ; port MOTOR4.RESET
SCK_NRF: P2_-_Radio.5 ; port Radio.SCK
SWCLK: P1_-_SWD.8 ; port SWD.SWCLK
SWDIO: P1_-_SWD.10 ; port SWD.SWDIO
SWO: P1_-_SWD.9 ; port SWD.SWO
USART1_GPIO: P7_-_LCD.5 ; port USART1.GPIO  [project net UART4_GPIO]
USART1_INT: P7_-_LCD.4 ; port USART1.INT  [project net UART4_INT]
USART1_RX: P7_-_LCD.2 ; port USART1.RX  [project net UART4_RX]
USART1_TX: P7_-_LCD.3 ; port USART1.TX  [project net UART4_TX]
USART2_GPIO: P13_-_RPI.5 ; port USART2.GPIO  [project net UART5_GPIO]
USART2_INT: P13_-_RPI.4 ; port USART2.INT  [project net UART5_INT]
USART2_RX: P13_-_RPI.2 ; port USART2.RX  [project net UART5_RX]
USART2_TX: P13_-_RPI.3 ; port USART2.TX  [project net UART5_TX]
USB_ESD_N: IC7.1(I/O1) P4.2(DM)
USB_ESD_P: IC7.3(I/O2) P4.3(DP)
USB_N: IC7.6(I/O1) ; port USB.DM
USB_P: IC7.4(I/O2) ; port USB.DP
VCAP: P1.10 ; port KICKER.ADC_CAP  [project net ADC3_INP9]
NetD9_1: D9.1(P) R22.1
NetP8_2: P8.2 ; port IR_LED1
NetP9_2: P9.2 ; port IR_LED2

Not connected (* = marked no-connect by the designer): P1 3 4 6; P1_-_SWD 4* 7*; P4 4(ID)* 6(SHIELD)*

### Layout directives
differential pair; differential pair class diff90: USB_ESD_N, USB_ESD_P, USB_N, USB_P

### Notes on the sheet
- (near P4) USB CONN
- (near P1_-_SWD) SWD
- (near P2_-_Radio) nRF24L01p
- POWER CONNECTOR
- (near P5) JUMPER 3V3
- (near P6) JUMPER 5V
- BALL DETECTION
- USART
- KICKER CONN
- DRIBBLER
- (in symbol 150060SS55040) R

### Library data of the parts
C4 C7 = CAP CER 0603 25V 100nF: as C1 on sheet Peripheral-ICs; Type: Ceramic Capacitor; Dimensions: 0603 (1608 metric); Voltage Rating: 25V; Series: SMD Comm Y5V; Value: 100nF
C5 = CAP CER 0603 6.3V 10uF: as C17 on sheet MCU-144pins; Type: Ceramic Capacitor; Dimensions: 0603 (1608 metric); Voltage Rating: 6.3V; Series: C; Value: 10uF
C6 = CAP ALUM 25V 10uF: Aluminum Electrolytic Capacitors - SMD 25volts 10uF 5x5.4 20%; Mfr: Nichion; Mfr Nr: UWX1E100MCL1GB; Voltage Rating: 25V; Type: Surface Mount Aluminum Electrolytic Capacitor; Dimensions: 5x5mm; Series: UWX; Value: 10uF
D9 = 150060SS55040: as D5 on sheet Peripheral-ICs; Package: 0603 (1608 metric); Series: WL-SMCD; Color: Red
IC6 = LD1117S33CTR: LOW DROPOUT REGULATORS(LDO) POSITIVE FIXED 1.3V @ 800MA 15V 3.3V 800MA SOT-223 ROHS; Mfr: STMicroelectronics; Series: LD1117; Package: SOT-223-3; Mfr Nr: LD1117S33CTR
IC7 = USBLC6-2SC6: DIODES - ESD SOT-23-6 ROHS; Mfr: STMicroelectronics; Series: USBLC6-2; Package: SOT-23-6; Mfr Nr: USBLC6-2SC6
P1 P16_-_Drible = HEADER 10P M
P1_-_SWD = HEADER 10P M: Headers & Wire Housings ArcherM50 1.27mmPitc DIL Vert Pin Head; Mfr: Harwin; Mfr Nr: M50-3600542R; Pitch: 1.27mm
P2_-_Radio P3_-_PWR = HEADER 8P F: Headers & Wire Housings 04+04 DIL VERTICAL SOCKET TIN; Mfr: Harwin; Mfr Nr: M20-7830446; Pitch: 2.54mm; Series: M20; Type: Socket Assembly; Contact Gender: Socket (Female)
P4 = USB Micro AB: USB Connectors WR-COM USB Micro SMT Type AB Horiztl; Mfr: Wurth Elektronik; Mfr Nr: 629105150921; Current Rating: 1.8 A; Gender: Jack (Female); Type: Micro USB AB; Series: WR-COM
P5 P6 = HEADER 3P M: as P17 on sheet MCU-144pins
P7_-_LCD P13_-_RPI = HEADER 6P M: Connector Header Through Hole 6 position 0.100" (2.54mm)
P8 P9 P11 P12 = HEADER 2P M
R22 = RES SMD 0603 470R: Thick Film Resistors 1/10Watt 470ohms 1% Commercial Use; Mfr: Vishay / Dale; Mfr Nr: CRCW0603470RFKEAC; Power Rating: 1/10 W; Dimensions: 0603 (1608 metric); Value: 470R
R23 = RES SMD 0603 1M: Thick Film Resistors - SMD 1/10Watt 1Mohms 1% Commercial Use; Mfr: Vishay / Dale; Mfr Nr: CRCW06031M00FKEAC; Power Rating: 1/10 W; Dimensions: 0603 (1608 metric); Value: 1M
R24 = RES SMD 0603 330K: Thick Film Resistors 1/10Watt 330Kohms 1% Commercial Use; Mfr: Vishay / Dale; Mfr Nr: CRCW0603330KFKEAC; Power Rating: 1/10 W; Dimensions: 0603 (1608 metric); Value: 330K

## Nets that join several sheets
3V3: Peripheral-ICs (16 pins), MCU-144pins (41 pins), SSL-2020-MainBoard-Connectors (12 pins)
5V: Peripheral-ICs (R18.2), SSL-2020-MainBoard-Connectors (11 pins)
GND: Peripheral-ICs (23 pins), MCU-144pins (44 pins), SSL-2020-MainBoard-Connectors (28 pins)
ADC1_INP5: MCU-144pins (IC8.47), SSL-2020-MainBoard-Connectors (P16_-_Drible.5)
ADC1_INP6: MCU-144pins (IC8.50), SSL-2020-MainBoard-Connectors (P14_-_M1_M2.18)
ADC2_INP6: MCU-144pins (IC8.54), SSL-2020-MainBoard-Connectors (P14_-_M1_M2.17)
ADC2_INP8: MCU-144pins (IC8.45), SSL-2020-MainBoard-Connectors (P15_-_M3_M4.18)
ADC2_INP9: MCU-144pins (IC8.46), SSL-2020-MainBoard-Connectors (P15_-_M3_M4.17)
ADC3_INP6: MCU-144pins (IC8.22), SSL-2020-MainBoard-Connectors (R23.1 R24.2)
ADC3_INP7: MCU-144pins (IC8.20), SSL-2020-MainBoard-Connectors (P12.2)
ADC3_INP8: MCU-144pins (IC8.18), SSL-2020-MainBoard-Connectors (P11.2)
ADC3_INP9: MCU-144pins (IC8.14), SSL-2020-MainBoard-Connectors (P1.10)
ENCA_M1: MCU-144pins (IC8.42), SSL-2020-MainBoard-Connectors (P14_-_M1_M2.19)
ENCA_M2: MCU-144pins (IC8.34), SSL-2020-MainBoard-Connectors (P14_-_M1_M2.20)
ENCA_M3: MCU-144pins (IC8.60), SSL-2020-MainBoard-Connectors (P15_-_M3_M4.19)
ENCA_M4: MCU-144pins (IC8.81), SSL-2020-MainBoard-Connectors (P15_-_M3_M4.20)
ENCB_M1: MCU-144pins (IC8.97), SSL-2020-MainBoard-Connectors (P14_-_M1_M2.21)
ENCB_M2: MCU-144pins (IC8.35), SSL-2020-MainBoard-Connectors (P14_-_M1_M2.22)
ENCB_M3: MCU-144pins (IC8.64), SSL-2020-MainBoard-Connectors (P15_-_M3_M4.21)
ENCB_M4: MCU-144pins (IC8.82), SSL-2020-MainBoard-Connectors (P15_-_M3_M4.22)
I2C1_SCL: Peripheral-ICs (IC1.1 IC2.22), MCU-144pins (IC8.136 R27.1)
I2C1_SDA: Peripheral-ICs (IC1.3 IC2.23), MCU-144pins (IC8.140 R26.1)
MISO_NRF: MCU-144pins (IC8.66), SSL-2020-MainBoard-Connectors (P2_-_Radio.7)
MOSI_NRF: MCU-144pins (IC8.67), SSL-2020-MainBoard-Connectors (P2_-_Radio.6)
NRST: MCU-144pins (5 pins), SSL-2020-MainBoard-Connectors (P1_-_SWD.6)
PWM_D: MCU-144pins (IC8.76), SSL-2020-MainBoard-Connectors (P16_-_Drible.1)
PWM_M1: MCU-144pins (IC8.37), SSL-2020-MainBoard-Connectors (P14_-_M1_M2.5)
PWM_M2: MCU-144pins (IC8.36), SSL-2020-MainBoard-Connectors (P14_-_M1_M2.6)
PWM_M3: MCU-144pins (IC8.98), SSL-2020-MainBoard-Connectors (P15_-_M3_M4.5)
PWM_M4: MCU-144pins (IC8.99), SSL-2020-MainBoard-Connectors (P15_-_M3_M4.6)
SCK_NRF: MCU-144pins (IC8.1), SSL-2020-MainBoard-Connectors (P2_-_Radio.5)
SCLK1: Peripheral-ICs (IC3.23 IC5.3), MCU-144pins (IC8.41)
SCLK2: Peripheral-ICs (CONN1.5), MCU-144pins (IC8.69)
SDI1: Peripheral-ICs (IC3.24 IC5.4), MCU-144pins (IC8.43)
SDI2: Peripheral-ICs (CONN1.3), MCU-144pins (IC8.27)
SDO1: Peripheral-ICs (IC3.9 IC5.7), MCU-144pins (IC8.124)
SDO2: Peripheral-ICs (CONN1.7), MCU-144pins (IC8.28)
SWCLK: MCU-144pins (IC8.109), SSL-2020-MainBoard-Connectors (P1_-_SWD.8)
SWDIO: MCU-144pins (IC8.105), SSL-2020-MainBoard-Connectors (P1_-_SWD.10)
SWO: MCU-144pins (IC8.133), SSL-2020-MainBoard-Connectors (P1_-_SWD.9)
UART4_GPIO: MCU-144pins (IC8.113), SSL-2020-MainBoard-Connectors (P7_-_LCD.5)
UART4_INT: MCU-144pins (IC8.110), SSL-2020-MainBoard-Connectors (P7_-_LCD.4)
UART4_RX: MCU-144pins (IC8.112), SSL-2020-MainBoard-Connectors (P7_-_LCD.2)
UART4_TX: MCU-144pins (IC8.111), SSL-2020-MainBoard-Connectors (P7_-_LCD.3)
UART5_GPIO: MCU-144pins (IC8.70), SSL-2020-MainBoard-Connectors (P13_-_RPI.5)
UART5_INT: MCU-144pins (IC8.75), SSL-2020-MainBoard-Connectors (P13_-_RPI.4)
UART5_RX: MCU-144pins (IC8.73), SSL-2020-MainBoard-Connectors (P13_-_RPI.2)
UART5_TX: MCU-144pins (IC8.74), SSL-2020-MainBoard-Connectors (P13_-_RPI.3)
USB_N: MCU-144pins (IC8.103), SSL-2020-MainBoard-Connectors (IC7.6)
USB_P: MCU-144pins (IC8.104), SSL-2020-MainBoard-Connectors (IC7.4)